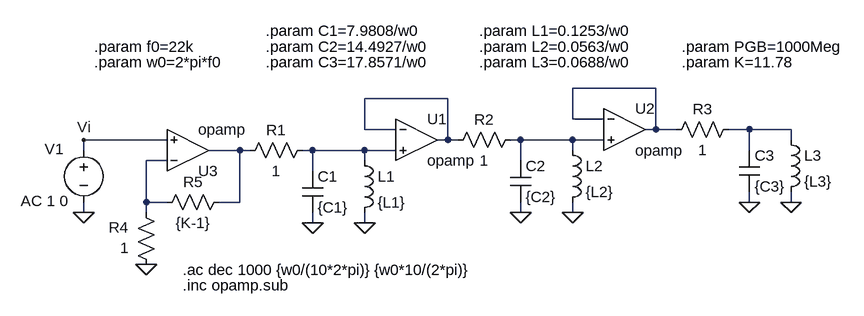
[diagram p0: schematic Cheby_BP_Orden6.asc]
Cheby_BP_Orden6.asc, the LTspice schematic file:
Version 4
SHEET 1 1328 680
WIRE 864 16 736 16
WIRE 544 32 416 32
WIRE 736 64 736 16
WIRE 784 64 736 64
WIRE 416 80 416 32
WIRE 464 80 416 80
WIRE 864 80 864 16
WIRE 864 80 848 80
WIRE 896 80 864 80
WIRE 1008 80 976 80
WIRE 1072 80 1008 80
WIRE 112 96 -16 96
WIRE 544 96 544 32
WIRE 544 96 528 96
WIRE 560 96 544 96
WIRE 656 96 640 96
WIRE 736 96 656 96
WIRE 784 96 736 96
WIRE 1072 96 1072 80
WIRE -16 112 -16 96
WIRE 224 112 176 112
WIRE 240 112 224 112
WIRE 336 112 320 112
WIRE 416 112 336 112
WIRE 464 112 416 112
WIRE 736 112 736 96
WIRE 1008 112 1008 80
WIRE 112 128 80 128
WIRE 416 128 416 112
WIRE 656 128 656 96
WIRE 336 144 336 112
WIRE 80 192 80 128
WIRE 112 192 80 192
WIRE 224 192 224 112
WIRE 224 192 192 192
WIRE 1008 192 1008 176
WIRE 1072 192 1072 176
WIRE -16 208 -16 192
WIRE 80 208 80 192
WIRE 656 208 656 192
WIRE 736 208 736 192
WIRE 336 224 336 208
WIRE 416 224 416 208
FLAG 416 224 0
FLAG 736 208 0
FLAG -16 208 0
FLAG 656 208 0
FLAG 336 224 0
FLAG 1072 192 0
FLAG 1008 192 0
FLAG -16 96 Vi
FLAG 80 288 0
SYMBOL res 336 96 R90
WINDOW 0 0 56 VBottom 2
WINDOW 3 32 56 VTop 2
SYMATTR InstName R1
SYMATTR Value 1
SYMBOL ind 400 112 R0
SYMATTR InstName L1
SYMATTR Value {L1}
SYMBOL Opamps\\opamp 496 32 R0
SYMATTR InstName U1
SYMATTR SpiceLine2 GBW={PGB}
SYMBOL res 656 80 R90
WINDOW 0 0 56 VBottom 2
WINDOW 3 32 56 VTop 2
SYMATTR InstName R2
SYMATTR Value 1
SYMBOL ind 720 96 R0
SYMATTR InstName L2
SYMATTR Value {L2}
SYMBOL voltage -16 96 R0
WINDOW 123 -97 94 Left 2
WINDOW 39 0 0 Left 0
WINDOW 0 -60 14 Left 2
SYMATTR Value2 AC 1 0
SYMATTR InstName V1
SYMATTR Value ""
SYMBOL cap 320 144 R0
SYMATTR InstName C1
SYMATTR Value {C1}
SYMBOL cap 640 128 R0
SYMATTR InstName C2
SYMATTR Value {C2}
SYMBOL Opamps\\opamp 816 16 R0
SYMATTR InstName U2
SYMATTR SpiceLine2 GBW={PGB}
SYMBOL res 992 64 R90
WINDOW 0 0 56 VBottom 2
WINDOW 3 32 56 VTop 2
SYMATTR InstName R3
SYMATTR Value 1
SYMBOL ind 1056 80 R0
SYMATTR InstName L3
SYMATTR Value {L3}
SYMBOL cap 992 112 R0
SYMATTR InstName C3
SYMATTR Value {C3}
SYMBOL Opamps\\opamp 144 176 M180
SYMATTR InstName U3
SYMATTR SpiceLine2 GBW={PGB}
SYMBOL res 64 192 R0
WINDOW 0 -42 39 Left 2
WINDOW 3 -24 70 Left 2
SYMATTR InstName R4
SYMATTR Value 1
SYMBOL res 208 176 R90
WINDOW 0 0 56 VBottom 2
WINDOW 3 32 56 VTop 2
SYMATTR InstName R5
SYMATTR Value {K-1}
TEXT 136 320 Left 2 !.inc opamp.sub
TEXT 136 296 Left 2 !.ac dec 1000 {w0/(10*2*pi)} {w0*10/(2*pi)}
TEXT 264 -72 Left 2 !.param C1=7.9808/w0
TEXT 264 -48 Left 2 !.param C2=14.4927/w0
TEXT 264 -24 Left 2 !.param C3=17.8571/w0
TEXT 0 -24 Left 2 !.param w0=2*pi*f0
TEXT 0 -48 Left 2 !.param f0=22k
TEXT 592 -72 Left 2 !.param L1=0.1253/w0
TEXT 592 -48 Left 2 !.param L2=0.0563/w0
TEXT 592 -24 Left 2 !.param L3=0.0688/w0
TEXT 904 -24 Left 2 !.param K=11.78
TEXT 904 -48 Left 2 !.param PGB=1000Meg

The netlist it stands for:
* Cheby_BP_Orden6.asc
R1 N006 N005 1
L1 N006 0 {L1}
XU1 N002 N006 N002 opamp Aol=100K GBW={PGB}  ; pins invin noninvin out
R2 N004 N002 1
L2 N004 0 {L2}
V1 Vi 0 AC 1 0
C1 N006 0 {C1}
C2 N004 0 {C2}
XU2 N001 N004 N001 opamp Aol=100K GBW={PGB}  ; pins invin noninvin out
R3 N003 N001 1
L3 N003 0 {L3}
C3 N003 0 {C3}
XU3 N007 Vi N005 opamp Aol=100K GBW={PGB}  ; pins invin noninvin out
R4 N007 0 1
R5 N005 N007 {K-1}
.inc opamp.sub
.ac dec 1000 {w0/(10*2*pi)} {w0*10/(2*pi)}
.param C1=7.9808/w0
.param C2=14.4927/w0
.param C3=17.8571/w0
.param w0=2*pi*f0
.param f0=22k
.param L1=0.1253/w0
.param L2=0.0563/w0
.param L3=0.0688/w0
.param K=11.78
.param PGB=1000Meg
.backanno
.end